# EAGLE design H1FR50 (EAGLE 9.6.2)

## Sheet 1 of 2
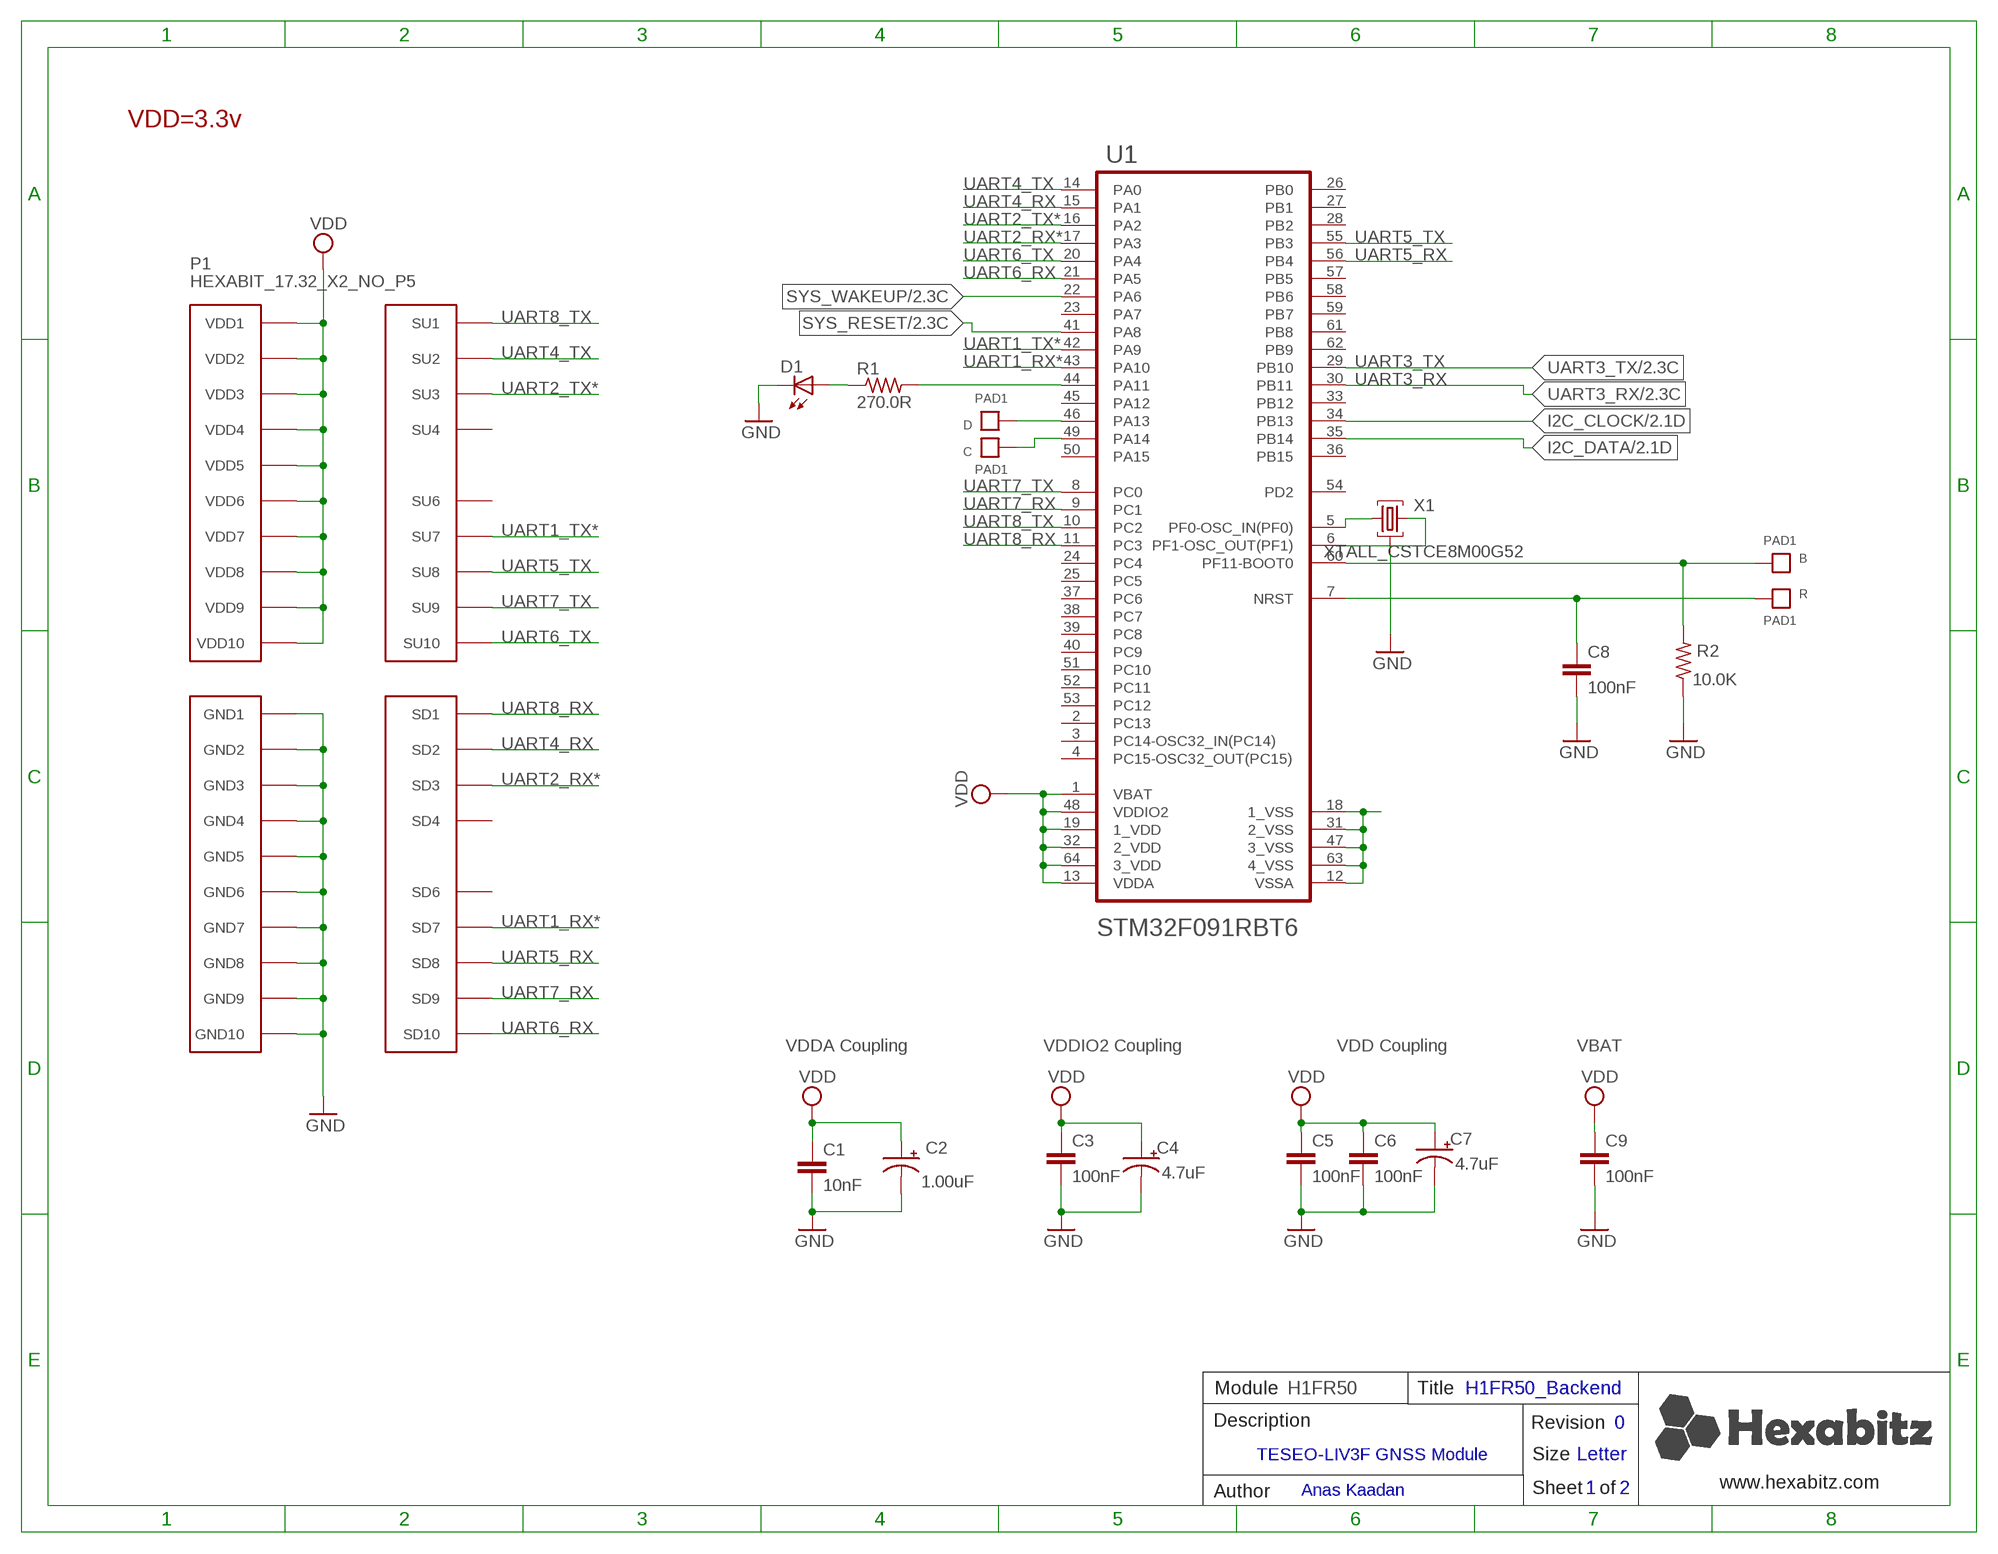
[diagram p0: schematic, sheet 1]

### Parts
B  PAD1  [PAD1]
C  PAD1  [PAD1]
C1  10nF  C-0603  [C-0603]
C2  1.00uF  C-0805-POL  [C-0805-POL]
C3  100nF  C-0603  [C-0603]
C4  4.7uF  C-0805-POL  [C-0805-POL]
C5  100nF  C-0603  [C-0603]
C6  100nF  C-0603  [C-0603]
C7  4.7uF  C-0805-POL  [C-0805-POL]
C8  100nF  C-0603  [C-0603]
C9  100nF  C-0603  [C-0603]
D  PAD1  [PAD1]
D1  VLMS1300-GS08  [VLMS1300-GS08]
P1  HEXABIT_17.32_X2_NO_P5  [HEXABIT_17.32_X2_NO_P5]
R  PAD1  [PAD1]
R1  270.0R  R-0603  [R-0603]
R2  10.0K  R-0603  [R-0603]
U1  STM32F091RBT6STMICROELECTRONICS_STM32F091RBT6_0_1  [STMICROELECTRONICS_STM32F091RBT6_1]
X1  XTALL_CSTCE8M00G52  [XTALL_CSTCE8M00G52]

### Nets
B1: B.P$1 B.P$2 R2.2 U1.60(PF11-BOOT0)
GND: C1.2 C2.2(-) C3.2 C4.2(-) C5.2 C6.2 C7.2(-) C8.2 C9.2 D1.C P1.PAD_PD11(GND1) P1.PAD_PD12(GND2) P1.PAD_PD13(GND3) P1.PAD_PD14(GND4) P1.PAD_PD15(GND5) P1.PAD_PD16(GND6) P1.PAD_PD17(GND7) P1.PAD_PD18(GND8) P1.PAD_PD19(GND9) P1.PAD_PD20(GND10) R2.1 U1.12(VSSA) U1.18(1_VSS) U1.31(2_VSS) U1.47(3_VSS) U1.63(4_VSS) X1.P$2 ; also sheet 2
I2C_CLOCK: U1.34(PB13) ; also sheet 2
I2C_DATA: U1.35(PB14) ; also sheet 2
N$4: D1.A R1.1
N$5: U1.5(PF0-OSC_IN(PF0)) X1.P$1
N$6: U1.6(PF1-OSC_OUT(PF1)) X1.P$3
N$7: D.P$1 D.P$2 U1.46(PA13)
N$9: C.P$1 C.P$2 U1.49(PA14)
N$10: R1.2 U1.44(PA11)
R1: C8.1 R.P$1 R.P$2 U1.7(NRST)
SYS_RESET: U1.41(PA8) ; also sheet 2
SYS_WAKEUP: U1.22(PA6) ; also sheet 2
UART1_RX*: P1.PAD_PD7(SD7) U1.43(PA10)
UART1_TX*: P1.PAD_PU7(SU7) U1.42(PA9)
UART2_RX*: P1.PAD_PD3(SD3) U1.17(PA3)
UART2_TX*: P1.PAD_PU3(SU3) U1.16(PA2)
UART3_RX: U1.30(PB11) ; also sheet 2
UART3_TX: U1.29(PB10) ; also sheet 2
UART4_RX: P1.PAD_PD2(SD2) U1.15(PA1)
UART4_TX: P1.PAD_PU2(SU2) U1.14(PA0)
UART5_RX: P1.PAD_PD8(SD8) U1.56(PB4)
UART5_TX: P1.PAD_PU8(SU8) U1.55(PB3)
UART6_RX: P1.PAD_PD10(SD10) U1.21(PA5)
UART6_TX: P1.PAD_PU10(SU10) U1.20(PA4)
UART7_RX: P1.PAD_PD9(SD9) U1.9(PC1)
UART7_TX: P1.PAD_PU9(SU9) U1.8(PC0)
UART8_RX: P1.PAD_PD1(SD1) U1.11(PC3)
UART8_TX: P1.PAD_PU1(SU1) U1.10(PC2)
VDD: C1.1 C2.1(+) C3.1 C4.1(+) C5.1 C6.1 C7.1(+) C9.1 P1.PAD_PU11(VDD1) P1.PAD_PU12(VDD2) P1.PAD_PU13(VDD3) P1.PAD_PU14(VDD4) P1.PAD_PU15(VDD5) P1.PAD_PU16(VDD6) P1.PAD_PU17(VDD7) P1.PAD_PU18(VDD8) P1.PAD_PU19(VDD9) P1.PAD_PU20(VDD10) U1.1(VBAT) U1.13(VDDA) U1.19(1_VDD) U1.32(2_VDD) U1.48(VDDIO2) U1.64(3_VDD) ; also sheet 2
Unconnected: P1.PAD_PD4(SD4) P1.PAD_PD6(SD6) P1.PAD_PU4(SU4) P1.PAD_PU6(SU6) U1.2(PC13) U1.3(PC14-OSC32_IN(PC14)) U1.4(PC15-OSC32_OUT(PC15)) U1.23(PA7) U1.24(PC4) U1.25(PC5) U1.26(PB0) U1.27(PB1) U1.28(PB2) U1.33(PB12) U1.36(PB15) U1.37(PC6) U1.38(PC7) U1.39(PC8) U1.40(PC9) U1.45(PA12) U1.50(PA15) U1.51(PC10) U1.52(PC11) U1.53(PC12) U1.54(PD2) U1.57(PB5) U1.58(PB6) U1.59(PB7) U1.61(PB8) U1.62(PB9)

### Notes on the sheet
- VDD=3.3v
- VDDA Coupling | VDDIO2 Coupling | VDD Coupling | VBAT
- Module | H1FR50 | Title | H1FR50_Backend
- Description | Revision | 0
- TESEO-LIV3F GNSS Module | Size | Letter
- www.hexabitz.com
- Author | Anas Kaadan | Sheet   of | 1 | 2
- C:/Users/Admin/Desktop/logodraft.bmp

## Sheet 2 of 2
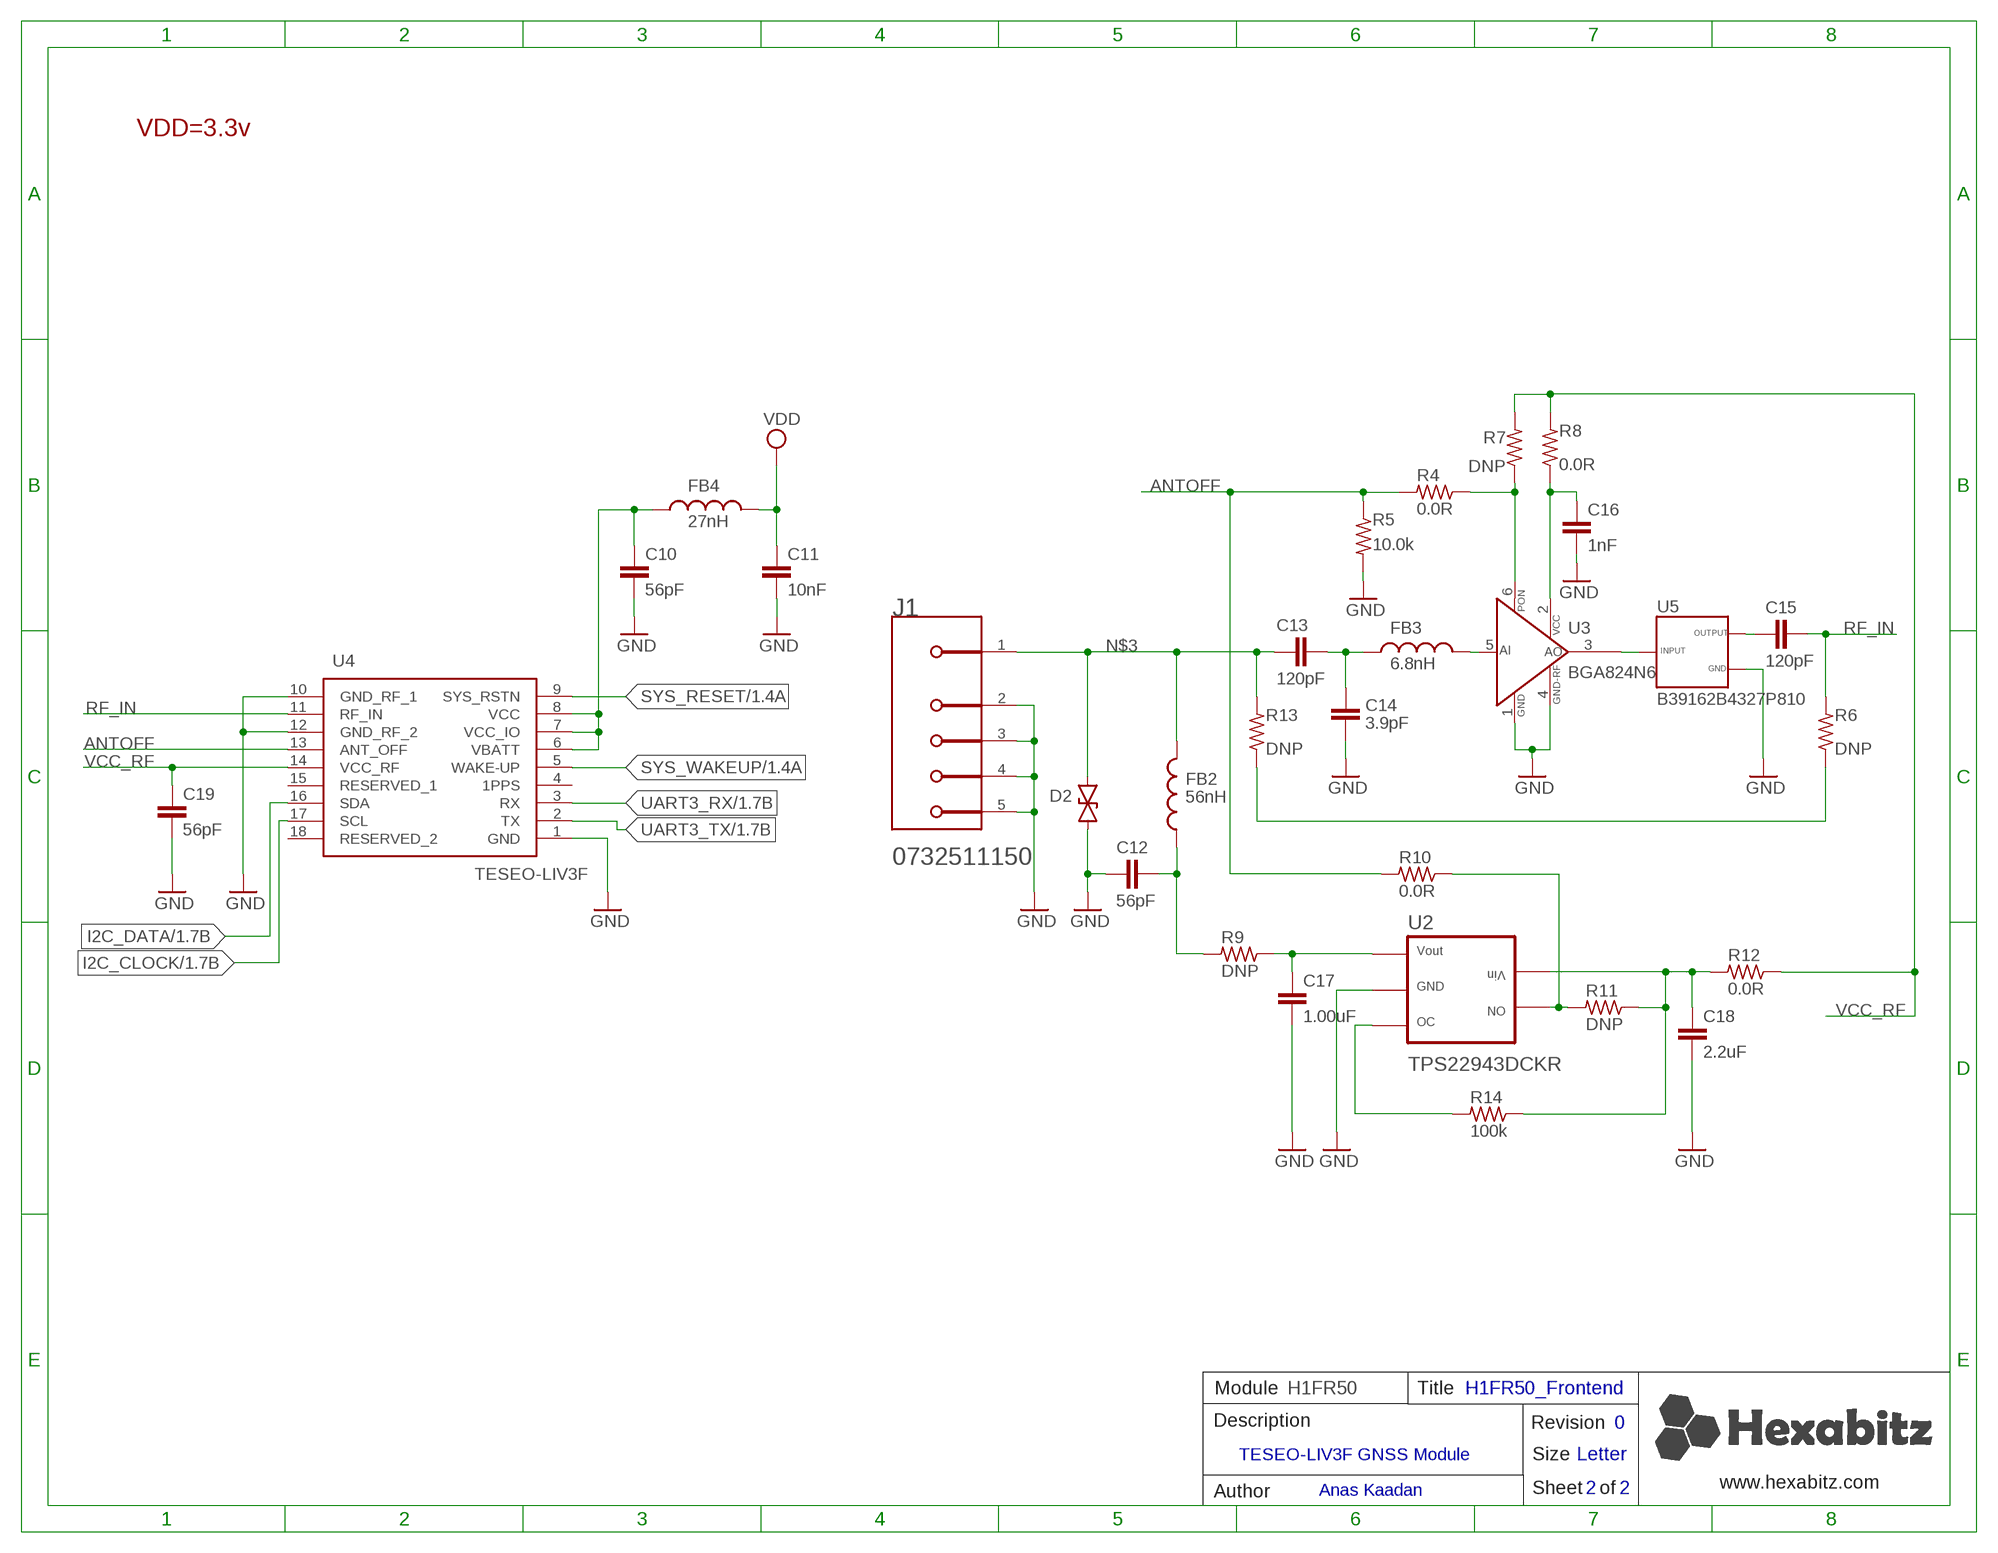
[diagram p1: schematic, sheet 2]

### Parts
C10  56pF  C-0201C0201  [C-0201]
C11  10nF  C-0402  [C-0402]
C12  56pF  C-0402  [C-0402]
C13  120pF  C-0402  [C-0402]
C14  3.9pF  C-0402  [C-0402]
C15  120pF  C-0402  [C-0402]
C16  1nF  C-0402  [C-0402]
C17  1.00uF  C-0402  [C-0402]
C18  2.2uF  C-0402  [C-0402]
C19  56pF  C-0201C0201  [C-0201]
D2  ESDARF02-1BU2CK  [CAPC0201X13N]
FB2  56nH  FB-0402  [FB-0402]
FB3  6.8nH  FB-0402  [FB-0402]
FB4  27nH  FB-0402  [FB-0402]
J1  MOLEX_INC_0732511150MOLEX_INC_0732511150_0_0  [MOLEX_INC_0732511150_0]
R4  0.0R  R-0402  [R-0402]
R5  10.0k  R-0402  [R-0402]
R6  DNP  R-0402  [R-0402]
R7  DNP  R-0402  [R-0402]
R8  0.0R  R-0402  [R-0402]
R9  DNP  R-0402  [R-0402]
R10  0.0R  R-0402  [R-0402]
R11  DNP  R-0402  [R-0402]
R12  0.0R  R-0402  [R-0402]
R13  DNP  R-0402  [R-0402]
R14  100k  R-0603  [R-0603]
U2  TPS22943DCKR  [SOT65P210X110-5N]
U3  BGA824N6  [BGA824N6]
U4  TESEO-LIV3F  [SON110P970X1010X230-18N]
U5  B39162B4327P810  [FIL_B39162B4327P810]

### Nets
ANT_IN: R6.1 R13.1
ANTOFF: R4.2 R5.1 R10.2 U4.13(ANT_OFF)
GND: C10.1 C11.1 C12.1 C14.1 C16.2 C17.2 C18.2 C19.1 D2.1 J1.2(MNT_1) J1.3(MNT_2) J1.4(MNT_3) J1.5(MNT_4) R5.2 U2.2(GND) U3.1(GND) U3.4(GND-RF) U4.1(GND) U4.10(GND_RF_1) U4.12(GND_RF_2) U5.2(GND) U5.3(GND) U5.5(GND) ; also sheet 1
I2C_CLOCK: U4.17(SCL) ; also sheet 1
I2C_DATA: U4.16(SDA) ; also sheet 1
N$1: C13.2 C14.2 FB3.1
N$2: R14.2 U2.3(OC)
N$3: C13.1 D2.2 FB2.2 J1.1 R13.2
N$11: C12.2 FB2.1 R9.2
N$12: FB3.2 U3.5(AI)
N$13: U3.3(AO) U5.1(INPUT)
N$16: R4.1 R7.1 U3.6(PON)
N$17: C15.1 U5.4(OUTPUT)
N$19: C16.1 R8.1 U3.2(VCC)
N$20: C17.1 R9.1 U2.1(VOUT)
N$22: R10.1 R11.2 U2.4(ON)
N$23: C18.1 R11.1 R12.2 R14.1 U2.5(VIN)
RF_IN: C15.2 R6.2 U4.11(RF_IN)
SYS_RESET: U4.9(SYS_RSTN) ; also sheet 1
SYS_WAKEUP: U4.5(WAKE-UP) ; also sheet 1
UART3_RX: U4.3(RX) ; also sheet 1
UART3_TX: U4.2(TX) ; also sheet 1
VCC_RF: C19.2 R7.2 R8.2 R12.1 U4.14(VCC_RF)
VCC_RF1: C10.2 FB4.1 U4.6(VBATT) U4.7(VCC_IO) U4.8(VCC)
VDD: C11.2 FB4.2 ; also sheet 1
Unconnected: U4.4(1PPS) U4.15(RESERVED_1) U4.18(RESERVED_2)

### Notes on the sheet
- VDD=3.3v
- Module | H1FR50 | Title | H1FR50_Frontend
- Description | Revision | 0
- TESEO-LIV3F GNSS Module | Size | Letter
- www.hexabitz.com
- Author | Anas Kaadan | Sheet   of | 2 | 2

## Library data of the parts
B C D R = Hexabitz:PAD1
C1 = Hexabitz:C-0603: CAP CER 10% X7R 0603; CAPACITANCE: 10nF; MFN: KEMET; MPN: C0603C103K5RACTU; OCTOPART_URL: https://octopart.com/c0603c103k5ractu-kemet-133094?r=sp&s=R_iPBxLnSmGqhkU2rIMFpg; TOLERANCE: 10%; VOLTAGE_RATING: 50V
C2 = Hexabitz:C-0805-POL: Cap Tant Solid SMD 2012; CAPACITANCE: 1.00uF; MFN: Yageo; MPN: CC0805KKX7R7BB105; OCTOPART_URL: https://octopart.com/cc0805kkx7r7bb105-yageo-8376555?r=sp&s=YKl1wwtkROau_X5nniH2ig; TOLERANCE: 10%; VOLTAGE_RATING: 16V
C3 C6 C8 = Hexabitz:C-0603: CAP CER 10% X7R 0603; CAPACITANCE: 100nF; MFN: KEMET; MPN: C0603C104K8RACTU; OCTOPART_URL: https://octopart.com/c0603c104k8ractu-kemet-145075?r=sp&s=9bS9ASSwSEqMCE9KBEQZ0g; TOLERANCE: 10%; VOLTAGE_RATING: 10V
C4 C7 = Hexabitz:C-0805-POL: Cap Tant Solid SMD 2012; CAPACITANCE: 4.7uF; MFN: Murata; MPN: GRM21BC81E475KA12L; OCTOPART_URL: https://octopart.com/grm21bc81e475ka12l-murata-10331911?r=sp&s=RY3qZSD8T6mG6TC9CHI5qQ; TOLERANCE: 10%; VOLTAGE_RATING: 25V
C5 = Hexabitz:C-0603: CAP CER 10% X7R 0603; CAPACITANCE: 100nF; MFN: KEMET; MPN: C0603C104K8RACTU; OCTOPART_URL: https://octopart.com/c0603c104k8ractu-kemet-145075?r=sp&s=9bS9ASSwSEqMCE9KBEQZ0g; TOLERANCE: 10%; VOLTAGE_RATING: 10
C9 = Hexabitz:C-0603: CAP CER 10% X7R 0603; CAPACITANCE: 100nF; MFN: KEMET; MPN: C0603C104K8RACTU; OCTOPART_URL: https://octopart.com/c0603c104k8ractu-kemet-145075?r=sp&s=9bS9ASSwSEqMCE9KBEQZ0g; TOLERANCE: 10V; VOLTAGE_RATING: 10%
C10 C19 = HEXABITZ_RCLS:C-0201: CAPACITOR, European symbol; MFN: Murata; MPN: GRM0335C1E560GA01D; OCTOPART_URL: https://octopart.com/grm0335c1e560ga01d-murata-24611383?r=sp
C11 = HEXABITZ_RCLS:C-0402: CAP CER 10% 0402; CAPACITANCE: 10nF; MFN: TDK; MPN: CGA2B3X7R1H103K050BE; OCTOPART_URL: https://octopart.com/cga2b3x7r1h103k050be-tdk-68305469?r=sp
C12 = HEXABITZ_RCLS:C-0402: CAP CER 10% 0402; CAPACITANCE: 56pF; MFN: Murata; MPN: GRM1555C1H560JA01D; OCTOPART_URL: https://octopart.com/grm1555c1h560ja01d-murata-15197568?r=sp
C13 C15 = HEXABITZ_RCLS:C-0402: CAP CER 10% 0402; CAPACITANCE: 120pF; MFN: Murata; MPN: GRM1555C1H121JA01D; OCTOPART_URL: https://octopart.com/grm1555c1h121ja01d-murata-196010?r=sp
C14 = HEXABITZ_RCLS:C-0402: CAP CER 10% 0402; CAPACITANCE: 3.9pF; MFN: Murata; MPN: GRM1555C1H3R9WA01D; OCTOPART_URL: https://octopart.com/grm1555c1h3r9wa01d-murata-20477997?r=sp
C16 = HEXABITZ_RCLS:C-0402: CAP CER 10% 0402; CAPACITANCE: 1nF; MFN: Murata; MPN: GRM155R71H102KA01D; OCTOPART_URL: https://octopart.com/grm155r71h102ka01d-murata-196021?r=sp
C17 = HEXABITZ_RCLS:C-0402: CAP CER 10% 0402; CAPACITANCE: 1.00uF; MFN: KEMET; MPN: C0402C105K8PAC7411; OCTOPART_URL: https://octopart.com/c0402c105k8pac7411-kemet-75146233?r=sp
C18 = HEXABITZ_RCLS:C-0402: CAP CER 10% 0402; CAPACITANCE: 2.2uF; MFN: https://octopart.com/c0402c225k7pactu-kemet-89187402?r=sp; MPN: C0402C225K7PACTU; OCTOPART_URL: https://octopart.com/c0402c225k7pactu-kemet-89187402?r=sp
D1 = Hexabitz:VLMS1300-GS08: Red 0603 130° Clear 54 mcd 2 V Surface Mount ChipLED ; Octopart Url : http://octopart.com/vlms1300-gs08-vishay-21709201; MFN: Vishay; MPN: VLMS1300-GS08; OCTOPART_URL: https://octopart.com/vlms1300-gs08-vishay-21709201?r=sp&s=_gcP4_q8T1SC6PJQPTQ9yA
D2 = HEXABITZ_RCLS:ESDARF02-1BU2CK: ESDARF Series 5 V 0.2 pF Bi-Directional 1-Line ESD Protection TVS Diode - ST0201; MFN: STMicroelectronics; MPN: ESDARF02-1BU2CK; OCTO_URL: https://octopart.com/search?q=ESDARF02-1BU2CK&currency=USD&specs=0
FB2 = HEXABITZ_RCLS:FB-0402; MFN: Murata; MPN: LQW15AN6N8G00D; OCTOPART_URL: https://octopart.com/lqw15an6n8g00d-murata-7896134?r=sp
FB3 = HEXABITZ_RCLS:FB-0402; MFN: Würth Elektronik; MPN: 744784156A; OCTOPART_URL: https://octopart.com/744784156a-w%C3%BCrth+elektronik-46756303?r=sp
FB4 = HEXABITZ_RCLS:FB-0402; MFN: Murata; MPN: LQG15HS27NJ02D; OCTOPART_URL: https://octopart.com/lqg15hs27nj02d-murata-387555?r=sp
J1 = HEXABITZ_CONNECTION_PARTS:MOLEX_INC_0732511150: RF/COAXIAL SMA JACK STR 50OHM EDGE MOUNT; CONTACT_MATERIAL: Gold,Nickel; DATASHEET: https://www.molex.com/webdocs/datasheets/pdf/en-us/0732511150_RF_COAX_CONNECTORS.pdf; DEVICE_CLASS_L1: Connectors; DEVICE_CLASS_L2: RF / Coaxial Connectors; DEVICE_CLASS_L3: unset; DIELECTRIC_MATERIAL: PTFE; DIGIKEY_DESCRIPTION: CONN SMA RCPT STR 50OHM EDGE MNT; DIGIKEY_PART_NUMBER: WM5534-ND; FOOTPRINT_URL: https://www.molex.com/pdm_docs/sd/732511150_sd.pdf; FOOTPRINT_VARIANT_NAME_0: Recommended_Land_Pattern; FREQUENCY: 18GHz; IMPEDANCE: 50Ω; IS_FEMALE: yes; LEAD_FREE: Yes; MF: Molex Inc; MFG_PACKAGE_IDENT: 0; MFG_PACKAGE_IDENT_DATE: 0; MFG_PACKAGE_IDENT_REV: 0; MOUSER_DESCRIPTION: RF Connectors / Coaxial Connectors SMA ST PCB-JCK STD EMT; MPN: 0732511150; NUMBER_OF_CONTACTS: 1; PACKAGE: CONN_RF_JACK; PREFIX: J; ROHS: Yes; SHIELDING: true; TEMPERATURE_RANGE_HIGH: +165°C; TEMPERATURE_RANGE_LOW: -65°C; VERIFICATION_VERSION: 0.0.0.3; VOLTAGE_RATING: 500V
P1 = hexabitz_connectors:HEXABIT_?_X2_NO_P5: Hexabitz Double Hexagon Module Connector Hexagon side length = 17.32mm. The following ports are removed: P5
R1 = Hexabitz:R-0603: Thick Film Resistors - SMD 0603; MFN: Yageo; MPN: RC0603FR-07270RL; OCTOPART_URL: https://octopart.com/search?q=RC0603FR-07270RL&start=0; RESISTANCE: 270.0 Ohm; TOLERANCE: 1%
R2 = Hexabitz:R-0603: Thick Film Resistors - SMD 0603; MFN: Yageo; MPN: RC0603JR-0710KL; OCTOPART_URL: https://octopart.com/search?q=RC0603JR-0710KL&start=0; RESISTANCE: 10.0K Ohm; TOLERANCE: 5%
R4 R6-R13 = HEXABITZ_RCLS:R-0402: Thick Film Resistors - SMD 0603
R5 = HEXABITZ_RCLS:R-0402: Thick Film Resistors - SMD 0603; MFN: TE Connectivity; MPN: CRGCQ0402F10K; OCTOPART_URL: https://octopart.com/crgcq0402f10k-te+connectivity-91017932?r=sp; RESISTANCE: 10.0K; TOLERANCE: ±1%
R14 = HEXABITZ_RCLS:R-0603: Thick Film Resistors - SMD 0603; MFN: Yageo; MPN: AC0603FR-07100KL; OCTOPART_URL: https://octopart.com/ac0603fr-07100kl-yageo-21711090?r=sp; RESISTANCE: 100k; TOLERANCE: ±1%
U1 = Hexabitz:STM32F091RBT6: MCU 32-bit ARM Cortex M0 RISC 128KB Flash 2.5V/3.3V 64-Pin LQFP Frame; CIIVA_IDS: 20240711; COMPONENT_LINK_1_DESCRIPTION: Manufacturer URL; COMPONENT_LINK_1_URL: http://www.st.com/; CORE: ARM Cortex-M0; DATASHEET: http://www.st.com/st-web-ui/static/active/en/resource/technical/document/datasheet/DM00115237.pdf; DATASHEET_VERSION: Rev. 2; DA_CONVERTER: 1; FLASH_SIZE_PROG_KB: 128; FOOTPRINT_VARIANT_NAME_0: Level C; FOOTPRINT_VARIANT_NAME_1: Level B; FOOTPRINT_VARIANT_NAME_2: Level A; IMPORTED: yes; IMPORTED_FROM: vault; IMPORT_TS: 1521852803; INTERNAL_RAM_SIZE_KB: 32; IOS_HIGH_CURRENT: 52; MF: STMicroelectronics; MFN: STMicroelectronics; MOUNTING_TECHNOLOGY: Surface Mount; MPN: STM32F091RBT6; OCTOPART_URL: https://octopart.com/stm32f091rbt6-stmicroelectronics-51988681?r=sp&s=nshh1g3RRwuzez1YsQrt1w; OPERATING_FREQUENCYF_PROCESSOR_SPEED_MHZ: 48; PACKAGE_DESCRIPTION: 64-Pin Low-profile Quad Flat Package, Body 10 x 10 mm, Pitch 0.5 mm; PACKAGE_REFERENCE: LQFP64; PACKING: Tray; PREFIX: U; RELEASE_DATE: 1490161467; SUPPLY_VOLTAGEVCC_MIN_V: 2; VAULT_GUID: 95B06E5F-7F06-470A-8EBC-FD74529BF319; VAULT_REVISION: C6B60D25-65BF-47EB-8D85-05054791449B
U2 = HEXABITZ_ICs:TPS22943DCKR: 5.5-V, 0.04-A, 500-mΩ, load switch with current limit and active high enable 5-SC70 -40 to 85; DESCRIPTION: 5.5-V, 0.04-A, 500-mΩ, load switch with current limit and active high enable 5-SC70 -40 to 85; MFN: Texas Instruments; MPN: TPS22943DCKR; PACKAGE: SOT-SC70-5 Texas Instruments; PURCHASE-URL: https://octopart.com/tps22943dckr-texas+instruments-12189794?r=sp
U3 = HEXABITZ_ICs:BGA824N6: BGA824N6 1.5 to 3.3 V 0.55 dB SMT Front End Low Noise Amplifier - TSNP-6-2; DESCRIPTION: GPS Amp Single Low Noise Amplifier 1615MHz 3.3V 6-Pin TSNP T/R; MFN: Infineon; MPN: BGA824N6E6327XTSA1; OCTO_URL: https://octopart.com/bga824n6e6327xtsa1-infineon-33343805?r=sp
U4 = HEXABITZ_ICs:TESEO-LIV3F: GPS Modules Tiny GNSS module; DESCRIPTION: - RF Receiver BeiDou, Galileo, GLONASS, GNSS, GPS 1.575GHz -163dBm 18-LCC (9.7x10.1); MF: STMicroelectronics; MP: TESEO-LIV3F; PACKAGE: SMD-18 STMicroelectronics; PURCHASE-URL: https://octopart.com/teseo-liv3f-stmicroelectronics-84762432?r=sp
U5 = HEXABITZ_ICs:B39162B4327P810: Frequency RF SAW Filter (Sound Acoustic Wave) Bandwidth 5-SMD; DESCRIPTION: Low-loss RF GPS + COMPASS + Galileo + GLONASS filter 1582.4 MHz; MFN: RF360 Holdings; MPN: B39162B4327P810; PACKAGE: SMD-5 TDK; PURCHASE-URL: https://octopart.com/b39162b4327p810-rf360+holdings-78742154?r=sp
X1 = Hexabitz:XTALL_CSTCE8M00G52: MURATA CSTCE8M00G52-R0 RESONATOR, SMD, 8MHZ ; Octopart Url : https://octopart.com/cstce8m00g52-r0-murata-7145559; MFN: Murata; MPN: CSTCE8M00G52Z-R0; OCTOPART_URL: https://octopart.com/cstce8m00g52z-r0-murata-17755941?r=sp&s=JDnNJnrHQhyS8Zk4ofFWXw

## Board
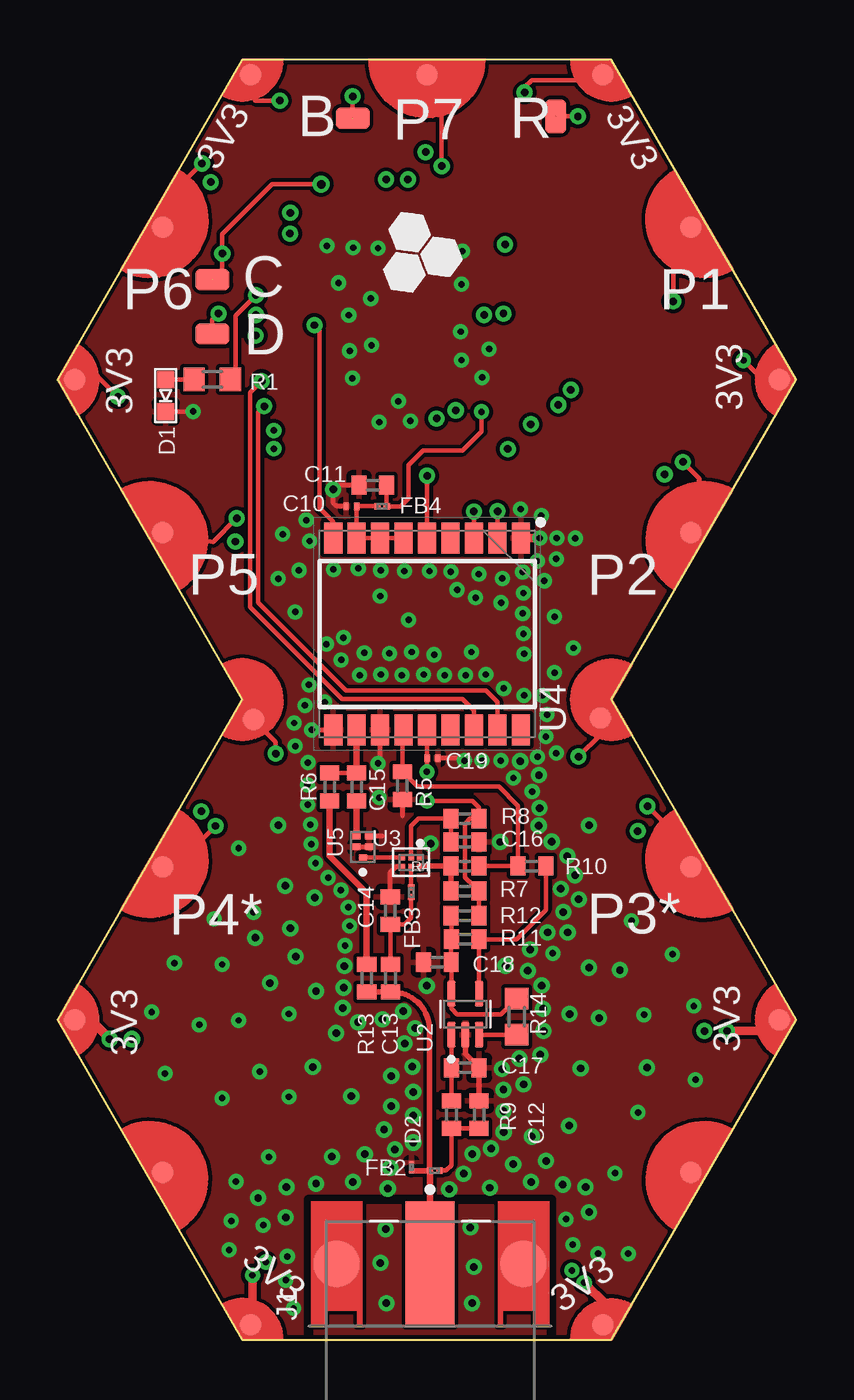
[diagram p2: board, top side]
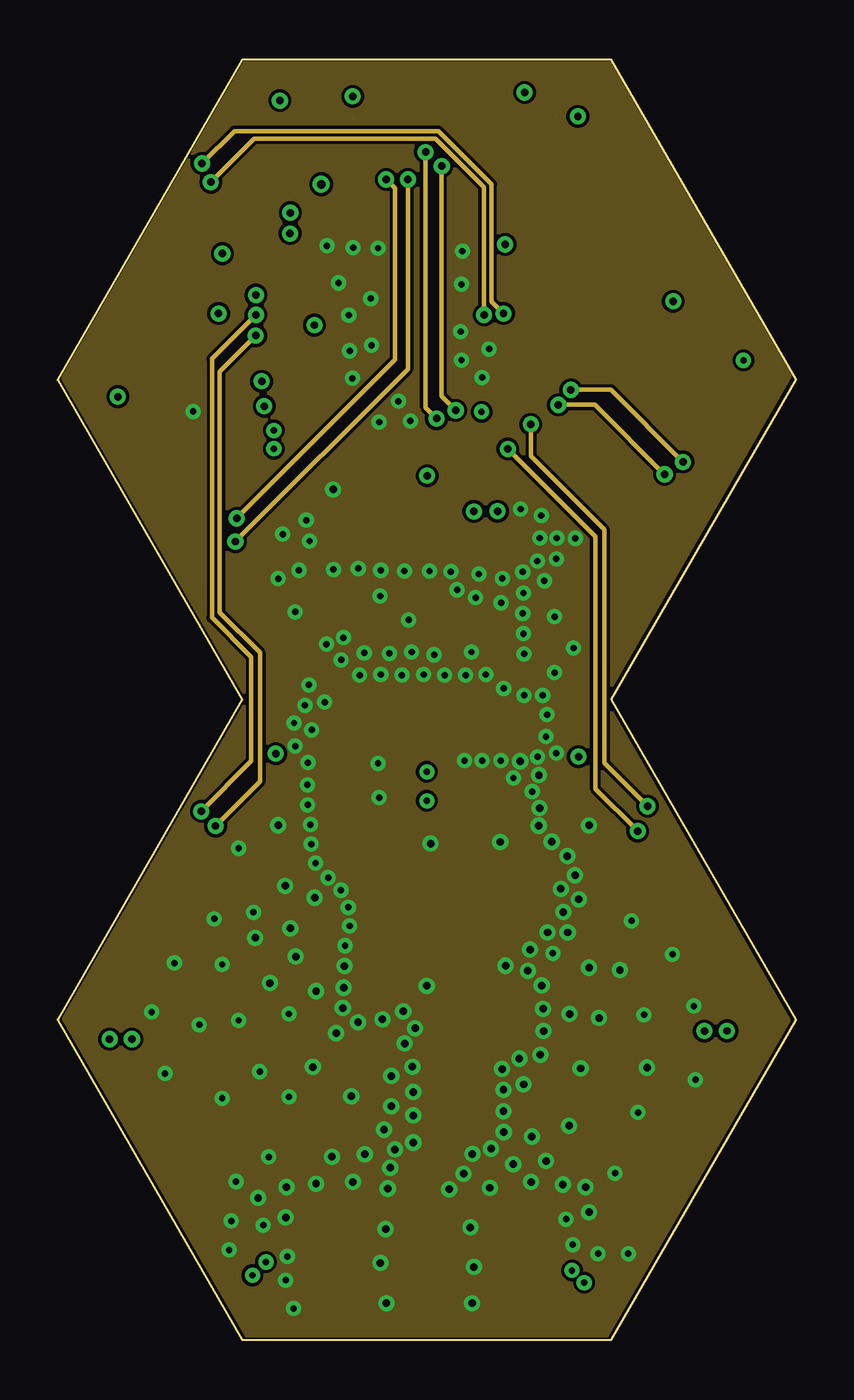
[diagram p3: board, inner layer Route2]
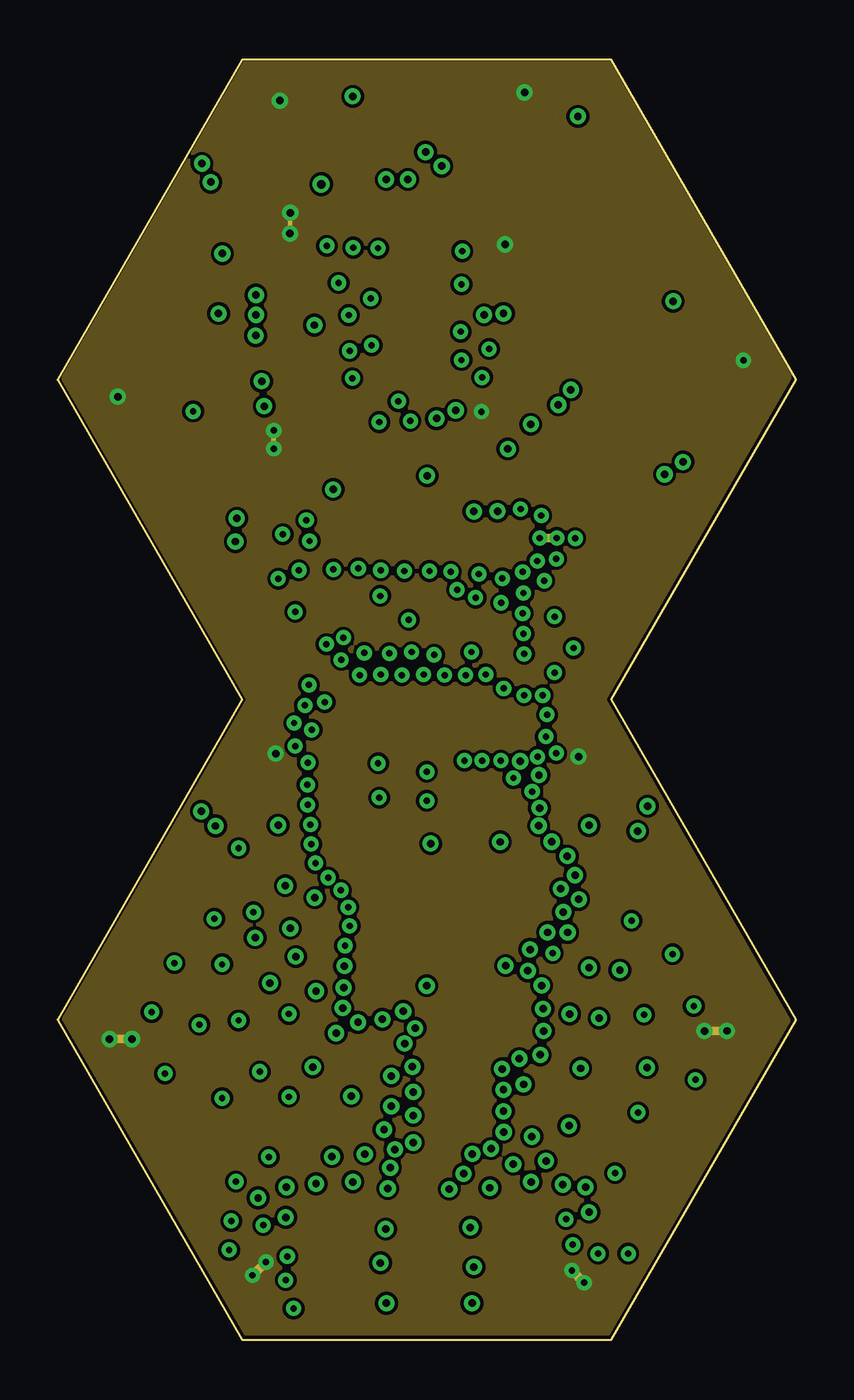
[diagram p4: board, inner layer Route15]
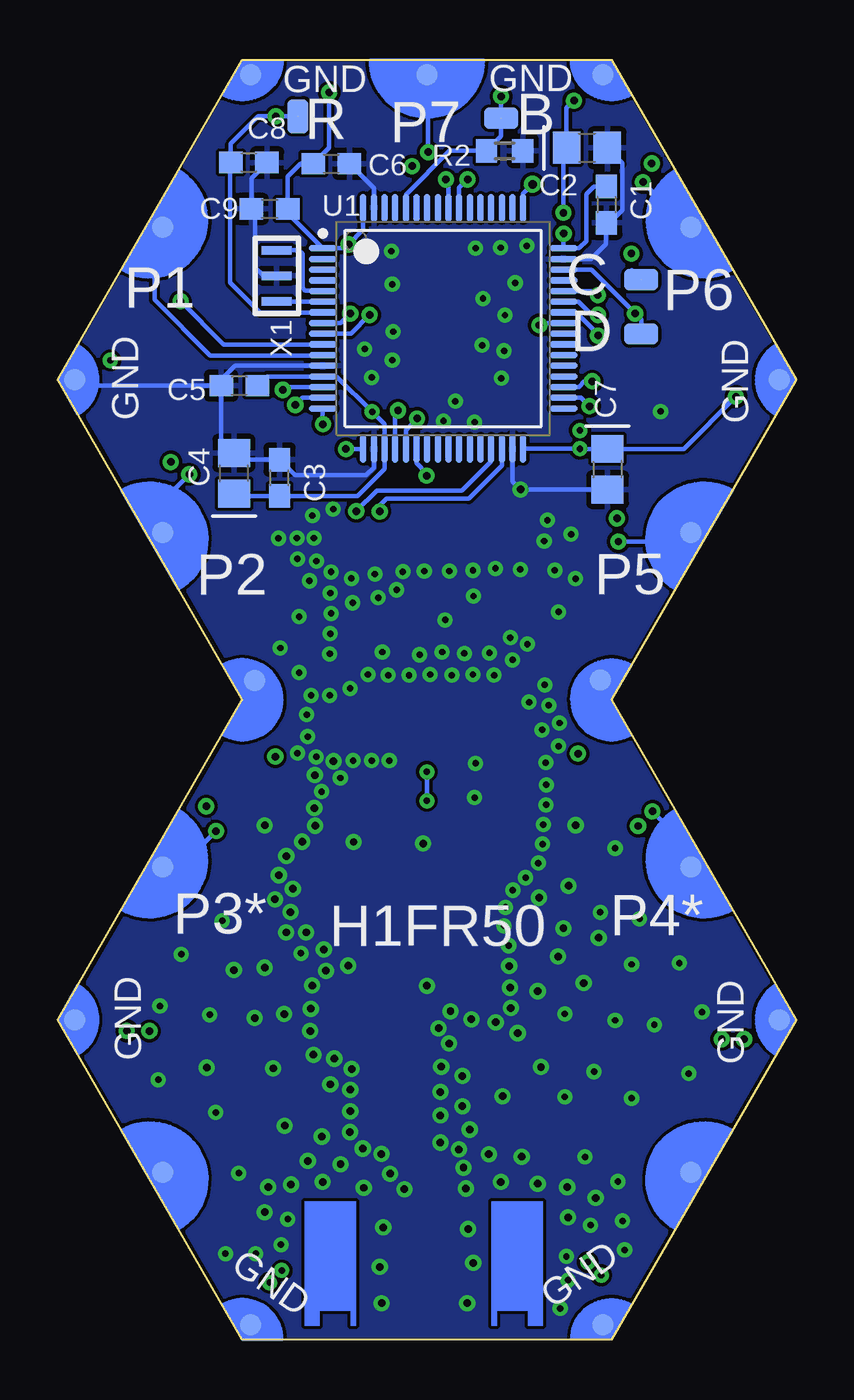
[diagram p5: board, bottom side, seen from below]

Size 34.64 x 60 mm. Coordinates in mm from the lower left corner, seen from the top.
Copper layers ([[2:1*2+15*16:15]:2]): Top 0.035mm / dielectric 0.175mm / Route2 0.035mm / dielectric 1.11mm / Route15 0.035mm / dielectric 0.175mm / Bottom 0.035mm
Design rules "2_layer *": minimum track width 7mil, minimum drill 10mil, track to track 6mil, track to pad 6mil, pad to pad 6mil, via to via 6mil, smd to smd 0mil, copper to edge 1mil, drill to drill 8mil, minimum pad ring 10mil, minimum via ring 8mil, stop-mask expansion 2mil, vias tented up to drill 15mil, thermal gap 10mil

### Footprints (pad centres in the part's own frame; a part is rotated, then mirrored left to right if it is on the bottom)
PAD1 = smd 1.6 x 1: P$1 0,0 | smd 1.6 x 1 bottom: P$2 0,0
C-0603 = smd 1.1 x 1: 1 -0.85,0; 2 0.85,0
C-0805-POL = smd 1.3 x 1.5: 1 -0.95,0; 2 0.95,0
C-0201 = smd 0.25 x 0.35: 1 -0.25,0; 2 0.25,0
C-0402 = smd 0.7 x 0.9: 1 -0.65,0; 2 0.65,0
VLMS1300-GS08 = smd 0.8 x 0.8: A 0,0.75; C 0,-0.75
CAPC0201X13N = smd 0.22 x 0.23: 1 -0.185,0; 2 0.185,0
FB-0402 = smd 0.29 x 0.3: 1 -0.222,0; 2 0.222,0
MOLEX_INC_0732511150_0 = smd 5.84 x 2.29: 1 5.309,0 | smd 2.173 x 2.173: 2 5.309,4.382; 3 5.309,-4.382; 4 5.309,4.382; 5 5.309,-4.382
HEXABIT_17.32_X2_NO_P5 = smd 1 x 1 bottom: PAD_PD1 12.39,7.15; PAD_PD2 12.39,-7.15; PAD_PD3 12.39,-22.85; PAD_PD4 12.39,-37.15; PAD_PD6 -12.39,-37.15; PAD_PD7 -12.39,-22.85; PAD_PD8 -12.39,-7.15; PAD_PD9 -12.39,7.15; PAD_PD10 0,14.31; PAD_PD12 16.52,0; PAD_PD13 8.069,-14.107; PAD_PD14 16.52,-30; PAD_PD15 8.26,-44.31; PAD_PD16 -8.26,-44.31; PAD_PD17 -16.52,-30; PAD_PD18 -8.133,-14.081; PAD_PD19 -16.52,0 | smd 1 x 1 rotated 60 bottom: PAD_PD11 8.26,14.307 | smd 1 x 1 rotated 120 bottom: PAD_PD20 -8.26,14.307 | smd 1 x 1: PAD_PU1 12.39,7.15; PAD_PU2 12.39,-7.15; PAD_PU3 12.39,-22.85; PAD_PU4 12.39,-37.15; PAD_PU6 -12.39,-37.15; PAD_PU7 -12.39,-22.85; PAD_PU8 -12.39,-7.15; PAD_PU9 -12.39,7.15; PAD_PU10 0,14.31; PAD_PU12 16.52,0; PAD_PU13 8.133,-15.847; PAD_PU14 16.52,-30; PAD_PU15 8.26,-44.31; PAD_PU16 -8.26,-44.31; PAD_PU17 -16.52,-30; PAD_PU18 -8.133,-15.936; PAD_PU19 -16.52,0 | smd 1 x 1 rotated 60: PAD_PU11 8.26,14.307 | smd 1 x 1 rotated 120: PAD_PU20 -8.26,14.307
R-0603 = smd 1 x 1.1: 1 -0.85,0; 2 0.85,0
R-0402 = smd 0.7 x 0.9: 1 -0.65,0; 2 0.65,0
STMICROELECTRONICS_STM32F091RBT6_1 = smd 1.3 x 0.3: 1 -5.65,3.75; 2 -5.65,3.25; 3 -5.65,2.75; 4 -5.65,2.25; 5 -5.65,1.75; 6 -5.65,1.25; 7 -5.65,0.75; 8 -5.65,0.25; 9 -5.65,-0.25; 10 -5.65,-0.75; 11 -5.65,-1.25; 12 -5.65,-1.75; 13 -5.65,-2.25; 14 -5.65,-2.75; 15 -5.65,-3.25; 16 -5.65,-3.75; 33 5.65,-3.75; 34 5.65,-3.25; 35 5.65,-2.75; 36 5.65,-2.25; 37 5.65,-1.75; 38 5.65,-1.25; 39 5.65,-0.75; 40 5.65,-0.25; 41 5.65,0.25; 42 5.65,0.75; 43 5.65,1.25; 44 5.65,1.75; 45 5.65,2.25; 46 5.65,2.75; 47 5.65,3.25; 48 5.65,3.75 | smd 0.3 x 1.3: 17 -3.75,-5.65; 18 -3.25,-5.65; 19 -2.75,-5.65; 20 -2.25,-5.65; 21 -1.75,-5.65; 22 -1.25,-5.65; 23 -0.75,-5.65; 24 -0.25,-5.65; 25 0.25,-5.65; 26 0.75,-5.65; 27 1.25,-5.65; 28 1.75,-5.65; 29 2.25,-5.65; 30 2.75,-5.65; 31 3.25,-5.65; 32 3.75,-5.65; 49 3.75,5.65; 50 3.25,5.65; 51 2.75,5.65; 52 2.25,5.65; 53 1.75,5.65; 54 1.25,5.65; 55 0.75,5.65; 56 0.25,5.65; 57 -0.25,5.65; 58 -0.75,5.65; 59 -1.25,5.65; 60 -1.75,5.65; 61 -2.25,5.65; 62 -2.75,5.65; 63 -3.25,5.65; 64 -3.75,5.65
SOT65P210X110-5N = smd 1.19 x 0.4: 1 -0.96,0.65; 2 -0.96,0; 3 -0.96,-0.65; 4 0.96,-0.65; 5 0.96,0.65
BGA824N6 = smd 0.25 x 0.25: 1 -0.2,0.4; 2 -0.2,0; 3 -0.2,-0.4; 4 0.2,-0.4; 5 0.2,0; 6 0.2,0.4
SON110P970X1010X230-18N = smd 1.45 x 0.85: 1 -4.5,4.4; 2 -4.5,3.3; 3 -4.5,2.2; 4 -4.5,1.1; 5 -4.5,0; 6 -4.5,-1.1; 7 -4.5,-2.2; 8 -4.5,-3.3; 9 -4.5,-4.4; 10 4.5,-4.4; 11 4.5,-3.3; 12 4.5,-2.2; 13 4.5,-1.1; 14 4.5,0; 15 4.5,1.1; 16 4.5,2.2; 17 4.5,3.3; 18 4.5,4.4
FIL_B39162B4327P810 = smd 0.3 x 0.375: 1 -0.5,0; 2 0,-0.287; 3 0.5,-0.287; 4 0.5,0.287; 5 0,0.287
XTALL_CSTCE8M00G52 = smd 1.4 x 0.4: P$1 0,1.2; P$2 0,0; P$3 0,-1.2

### Placement (x,y rotation side)
B  13.84,57.27 0 top
C  7.27,49.7 0 top
C1  8.9,53.21 270 bottom
C2  9.82,55.88 0 bottom
C3  24.23,40.4 90 bottom
C4  26.37,40.62 90 bottom
C5  26.11,44.73 180 bottom
C6  21.8,55.13 0 bottom
C7  8.85,40.81 270 bottom
C8  25.67,55.19 0 bottom
C9  24.7,53.01 180 bottom
C10  13.78,39.07 0 top
C11  14.79,40.06 0 top
C12  19.77,10.54 270 top
C13  15.62,16.95 90 top
C14  15.6,20.11 270 top
C15  14.03,25.91 90 top
C16  19.11,23.33 0 top
C17  19.12,12.74 0 top
C18  17.81,17.69 180 top
C19  17.58,27.27 180 top
D  7.27,47.16 180 top
D1  5.07,44.26 0 top
D2  16.59,8.09 270 top
FB2  17.69,7.93 180 top
FB3  16.58,20.97 90 top
FB4  15.22,39.07 0 top
J1  17.47,-1.75 90 top
P1  17.32,45 0 top
R  23.37,57.36 90 top
R1  7.26,45.02 0 top
R2  13.67,55.74 180 bottom
R4  19.11,22.2 0 top
R5  16.17,25.97 270 top
R6  12.76,25.91 90 top
R7  19.11,21.03 0 top
R8  19.11,24.43 0 top
R9  18.47,10.54 270 top
R10  22.24,22.2 180 top
R11  19.12,18.77 0 top
R12  19.11,19.88 180 top
R13  14.5,16.95 270 top
R14  21.53,15.14 270 top
U1  16.56,47.41 0 bottom
U2  19.12,15.26 90 top
U3  16.58,22.38 270 top
U4  17.33,33.09 270 top
U5  14.32,23.1 90 top
X1  24.36,49.87 0 bottom

### Tracks (layer width: path | path; a pad name or v marks a point on that pad's centre or on a via)
ANT_IN
  Top 0.305: R13.1 14.5,20.95 12.76,22.69 R6.1
ANTOFF
  Top 0.203: U4.13 16.17,28.53 R5.1 16.88,25.92 20.7,25.92 21.6,25.02 R10.2 R4.2
B1  (via drill 0.35)  (1 unrouted)
  Top 0.203: v13.84,58.29 B.P$1
  Bottom 0.203: U1.60 18.31,53.69 16.26,55.74 R2.2 13.84,56.42 v13.84,58.29
GND  (via drill 0.3, 0.35)
  Top 0.203: U5.5 U5.2 | R5.2 16.17,24.54 | 15.24,23.6 U5.3 | U4.10 v11.92,28.59 | v22.61,37.59 v22.61,37.58 | C19.1 18.96,27.27 v19.08,27.14 | v15.03,27.02 15.13,27.12 U4.12 | v6.36,43.51 v6.35,43.51 D1.C | C11.1 13.13,40.06 v12.93,39.86 12.93,39.22 13.07,39.07 C10.1 | C14.1 15.6,21.89 15.89,22.18 U3.4
  Top 0.254: C12.1 C17.2 19.12,13.39 U2.2
  Top 0.406: U4.1 v22.61,37.59
  Route15 0.406: v22.61,37.58 v23.41,37.58
  Bottom 0.203: C6.2 19.81,53.99 U1.63 | U1.47 9.62,50.66 8.93,51.35 C1.2 8.75,52.36 8.15,52.96 8.15,55.16 C2.2 8.93,55.82 | U1.12 26.32,45.66 26.96,45.02 C5.2 | C5.2 26.96,42.03 26.5,41.57 C4.2 26.05,41.25 C3.2 23.5,40.53 20.16,40.53 19.81,40.89 U1.18 | X1.P$2 24.97,49.87 25.37,50.27 25.37,52.84 C9.2 25.55,54.46 C8.2 | U1.31 13.31,40.24 v12.93,39.86 C7.2 | C5.2 33.57,44.73 P1.PAD_PD12
  Bottom 0.254: v24.19,32.42 v24.2,32.43
  other vias: 11.73,25.07 23.22,18.11 11.74,27.05 11.72,26.01 11.86,24.15 11.89,23.23 12.1,22.34 12.69,21.66 13.29,21.07 13.7,19.4 13.63,20.27 13.48,18.47 10.85,15.27 8.49,23.04 9.19,20.03 7.35,19.73 5.48,17.66 4.41,15.36 5.04,12.47 6.65,14.76 7.72,17.59 8.49,14.96 9.48,12.56 7.72,11.32 10.85,11.38 9.65,5.36 8.05,4.21 8.36,7.41 9.9,8.56 25.34,4.03 26.77,4.03 23.85,5.64 26.14,7.8 27.22,10.65 29.92,12.18 27.5,15.23 28.84,18.06 29.84,15.64 26.92,19.64 19.91,27.14 20.78,27.14 15.08,25.42 12.53,29.89 11.79,30.7 11.15,34.12 10.34,35.68 11.32,36.07 10.56,37.76 11.67,38.42 11.82,37.44 12.94,36.11 14.1,36.16 15.16,36.07 15.13,34.86 12.61,32.6 13.41,32.91 13.3,31.87 15.56,32.17 14.38,32.2 14.17,31.16 15.16,31.18 16.15,31.16 16.61,32.24 16.47,33.75 16.26,36.03 17.44,36.03 18.45,36.01 19.6,34.79 19.76,35.89 20.86,35.69 20.8,34.55 17.66,32.11 17.16,31.18 18.16,31.16 19.13,31.16 19.41,32.24 20.09,31.18 20.92,30.53 21.88,30.2 23.31,31.27 21.88,32.15 21.85,33.1 21.81,34.05 21.85,35 21.81,36 22.83,35.58 23.31,33.9 12.63,51.29 13.86,51.2 13.18,49.55 13.66,48.03 13.7,46.36 13.82,45.08 14.73,46.62 14.69,48.81 15.03,51.17 18.98,51.03 18.94,49.48 18.9,47.26 15.98,44 15.08,43.02 16.54,43.07 19.91,45.11 18.94,45.93 20.24,46.45 11.6,29.73 11.09,28.91 11.15,27.83 24.28,37.57 8.15,5.57 10.78,3.9 10.7,2.78 11.07,1.46 24.16,4.45 22.26,25.7 21.38,26.33 22.51,27.32 23.39,27.5 22.91,28.27 22.96,29.3 22.75,30.2 21.71,38.94 22.69,38.64 18.74,35.16 22.5,36.5 23.39,36.6 10.34,24.12 10.68,21.28 12.06,20.72 10.92,19.28 21.7,27.12 22.6,24.92 22.56,24.1 22.58,26.47 20.76,23.33 23.17,23.35 24.92,24.11 23.91,22.67 24.26,21.77 23.6,21.14 23.72,20.04 24.44,20.64 22.98,19.09 21.01,17.53 22.05,17.29 22.16,18.29 22.7,16.6 9.27,18.84 9.96,16.72 11.17,17.96 12.12,16.34 15.42,1.71 15.15,3.6 15.39,5.18 19.44,1.71 19.53,3.41 19.36,5.26 18.37,7.05 19.04,7.78 19.45,8.7 20.33,8.96 20.92,9.73 20.91,10.71 20.91,11.71 20.85,12.69 21.66,13.17 21.85,11.97 22.64,13.35 22.79,14.47 22.77,15.51 24.01,15.27 16.21,15.4 15.23,15.01 14.09,14.88 13.38,15.55 13.42,16.5 13.46,17.52 13.06,14.37 11.97,12.78 13.77,11.41 16.28,13.88 16.77,14.6 15.65,12.36 16.64,12.79 16.68,11.61 15.65,10.94 16.68,10.51 16.68,9.24 15.82,8.92 15.31,9.85 15.49,7.08 13.85,7.39 12.12,7.31 15.6,8.06 14.41,8.69 12.87,8.58 10.7,5.73 9.41,6.65 10.74,7.15 20.28,7.12 21.37,8.22 22.24,9.52 22.21,7.39 22.91,8.37 24.92,5.97 23.69,7.27 24.76,7.15 23.98,10.02 23.92,19.09 24.92,17.44 25.39,15.08 24.53,12.72 27.64,12.75 26.37,17.33 17.32,16.59 17.5,23.26
  pour Bottom: 8.73,59.91 0.21,45.16 8.94,30.01 0.3,15.03 8.87,0.18 25.76,0.18 34.27,14.92 25.59,30 34.39,45.28 25.95,59.91
  pour Route2: 8.75,59.88 0.22,45.13 8.94,30.01 0.3,15.03 8.87,0.19 25.77,0.19 34.3,14.97 25.62,30.03 34.39,45.24 25.93,59.88
  pour Top (isolate 0.178): 25.84,59.88 8.78,59.88 0.23,45.09 8.9,30.04 0.27,15.07 8.81,0.17 25.83,0.17 34.24,14.86 25.53,29.98 34.31,45.21
I2C_CLOCK  (via drill 0.35)
  Top 0.203: U4.17 20.63,29.9 20.1,30.42 13.53,30.42 9.4,34.55 9.4,43.48 v9.69,43.77
  Bottom 0.203: U1.34 10.09,44.16 v9.69,43.77
I2C_DATA  (via drill 0.35)
  Top 0.203: U4.16 19.53,29.5 18.99,30.04 13.34,30.04 9.03,34.35 9.03,44.4 v9.57,44.94
  Bottom 0.203: U1.35 10.2,44.66 9.93,44.94 v9.57,44.94
N$1
  Top 0.203: C13.2 15.62,19.44 C14.2 16.26,19.46 16.58,19.78 FB3.1
N$2
  Top 0.203: U2.3 R14.2
N$3
  Top 0.203: FB2.2 17.44,7.91
  Top 0.254: R13.2 C13.1 15.68,16.3 arc-90 17.45,14.52 17.45,7.97 17.46,7.95 FB2.2 | 17.44,7.91 D2.2
  Top 0.305: J1.1 FB2.2
N$4
  Top 0.203: D1.A R1.1
N$5
  Bottom 0.203: U1.5 22.23,49.19 23.03,49.19 23.16,49.32 23.16,50.9 23.33,51.07 X1.P$1
N$6
  Bottom 0.203: X1.P$3 24.35,48.66 U1.6
N$7  (via drill 0.35)
  Top 0.203: v7.55,48.11 7.26,47.82 7.26,47.43 7.27,47.41 D.P$1
  Bottom 0.203: U1.46 9.6,50.16 v7.55,48.11 7.27,47.83 D.P$1
N$9  (via drill 0.35, 0.4)  (1 unrouted)
  Top 0.203: C.P$1 7.73,50.16 v7.73,50.92 7.73,51.83 10.07,54.17 v12.36,54.17
  Bottom 0.203: C.P$1 7.72,50.14 | U1.49 12.81,53.73 v12.36,54.17
N$10  (via drill 0.35)
  Top 0.203: v9.31,48.97 8.35,48.02 8.35,45.26 R1.2
  Bottom 0.203: U1.44 9.5,49.16 v9.31,48.97
N$11
  Top 0.203: FB2.1 18.23,7.93 18.47,8.18 R9.2 C12.2
N$12
  Top 0.203: FB3.2 U3.5
N$13
  Top 0.203: U5.1 16.16,22.6 U3.3
N$16
  Top 0.254: U3.6 17,22.2 R4.1 R7.1
N$17
  Top 0.305: U5.4 C15.1
N$19
  Top 0.203: U3.2 16.58,24.08 16.92,24.43 R8.1 C16.1
N$20
  Top 0.203: R9.1 C17.1 U2.1
N$22
  Top 0.203: R10.1 22.9,20.15 21.52,18.77 R11.2 U2.4
N$23
  Top 0.203: R12.2 18.47,19.87 R11.1 C18.1 18.47,17.69 U2.5 18.47,15.53 18.74,15.26 20.8,15.26 R14.1
R1  (via drill 0.35)  (1 unrouted)
  Top 0.203: R.P$1 v24.4,57.36
  Bottom 0.203: U1.7 25.14,48.16 26.54,49.56 26.54,55.16 C8.1 26.52,56.07 25.23,57.36 R.P$1
RF_IN
  Top 0.203: U4.11 | C15.2 R6.2
  Top 0.305: C15.2 U4.11
SYS_RESET  (via drill 0.35)
  Top 0.203: v12.05,47.56 12.3,47.32 12.3,38.98 12.93,38.35 U4.9
  Bottom 0.203: U1.41 11.95,47.66 v12.05,47.56
SYS_WAKEUP  (via drill 0.35)
  Top 0.203: v17.33,40.5 U4.5
  Bottom 0.203: U1.22 17.81,41.09 17.33,40.61 v17.33,40.5
UART1_RX*  (via drill 0.35)
  Route2 0.203: v9.3,48.05 7.25,45.99 7.25,33.85 9.09,32.01 9.09,27.12 v6.74,24.77
  Bottom 0.203: U1.43 10.21,48.66 9.6,48.05 v9.3,48.05 | v6.74,24.77 5.09,23.12 P1.PAD_PD7
UART1_TX*  (via drill 0.35)
  Top 0.203: v7.41,24.08 5.59,22.26 P1.PAD_PU7
  Route2 0.203: v9.29,47.08 7.61,45.4 7.61,34.1 9.49,32.22 9.49,26.17 v7.41,24.08
  Bottom 0.203: U1.42 10.32,48.16 9.29,47.14 v9.29,47.08
UART2_RX*  (via drill 0.35)
  Route2 0.203: v21.11,41.76 25.23,37.65 25.23,25.82 v27.21,23.84
  Bottom 0.203: U1.17 v21.11,41.76 | v27.21,23.84 29.01,22.04 P1.PAD_PD3
UART2_TX*  (via drill 0.35)
  Top 0.203: v27.67,25.01 29.82,22.85 P1.PAD_PU3
  Route2 0.203: v22.19,42.92 22.19,41.42 25.64,37.98 25.64,27.04 v27.67,25.01
  Bottom 0.203: U1.16 v22.21,42.93 v22.19,42.92
UART3_RX  (via drill 0.35)
  Top 0.203: v19.53,38.83 U4.3
  Bottom 0.203: U1.30 13.81,40.97 15.35,39.42 19.22,39.42 19.53,39.12 v19.53,38.83
UART3_TX  (via drill 0.35)
  Top 0.203: U4.2 v20.63,38.84
  Bottom 0.203: U1.29 14.31,41.17 15.67,39.81 19.67,39.81 v20.63,38.84
UART4_RX  (via drill 0.35)
  Route2 0.203: v23.49,43.83 25.21,43.83 v28.47,40.57
  Bottom 0.203: U1.15 23.16,44.16 v23.49,43.83 | v28.47,40.57 29.91,39.12 P1.PAD_PD2
UART4_TX  (via drill 0.35)
  Top 0.203: v29.33,41.15 30.11,40.37 P1.PAD_PU2
  Route2 0.203: v24.07,44.53 25.95,44.53 v29.33,41.15
  Bottom 0.203: U1.14 23.94,44.66 v24.07,44.53
UART5_RX  (via drill 0.35)
  Route2 0.203: v16.43,54.4 16.43,45.51 v8.34,37.42
  Bottom 0.203: U1.56 16.31,54.27 v16.43,54.4 | v8.34,37.42 5,37.42 P1.PAD_PD8
UART5_TX  (via drill 0.35)
  Top 0.203: v8.4,38.51 7.29,37.4 P1.PAD_PU8
  Route2 0.203: v15.41,54.4 15.83,53.98 15.83,45.94 v8.4,38.51
  Bottom 0.203: U1.55 15.81,54 v15.41,54.4
UART6_RX  (via drill 0.35)
  Route2 0.203: v17.77,43.18 17.26,43.7 v17.26,55.68
  Bottom 0.203: U1.21 18.31,42.65 v17.77,43.18 | v17.26,55.68 17.26,59.7 P1.PAD_PD10
UART6_TX  (via drill 0.35)
  Top 0.203: P1.PAD_PU10 18.02,58.61 v18.02,55.02
  Route2 0.203: v18.67,43.57 18.02,44.23 v18.02,55.02
  Bottom 0.203: U1.20 18.81,43.44 v18.67,43.57
UART7_RX  (via drill 0.35)
  Route2 0.203: v20,48.05 20,54.02 17.71,56.31 9.22,56.31 v7.18,54.27
  Bottom 0.203: U1.9 20.89,47.16 v20,48.05 | v7.18,54.27 5.09,52.18 P1.PAD_PD9
UART7_TX  (via drill 0.35)
  Top 0.203: v6.78,55.15 6.1,54.47 6.1,53.99 5.51,53.4 4.99,52.49 P1.PAD_PU9
  Route2 0.203: v20.91,48.11 20.36,48.66 20.36,54.17 17.86,56.67 8.3,56.67 v6.78,55.15
  Bottom 0.203: U1.8 21.36,47.66 v20.91,48.11
UART8_RX
  Bottom 0.203: U1.11 22.23,46.14 27.48,46.14 30.09,48.76 30.09,51.77 P1.PAD_PD1
UART8_TX  (via drill 0.35)
  Top 0.203: v28.87,48.68 28.87,51.31 P1.PAD_PU1
  Bottom 0.203: U1.10 26.85,46.66 v28.87,48.68
VCC_RF  (via drill 0.3)
  Top 0.203: R12.1 R7.2 19.32,21.47 19.3,21.47 19.11,21.67 19.11,24.18 19.35,24.43 R8.2 19.76,24.96 19.45,25.26 v17.32,25.26 | U4.14 C19.2 17.33,26.64 v17.32,26.62
  Bottom 0.203: v17.32,26.62 v17.32,25.26
VCC_RF1
  Top 0.203: U4.6 U4.7 U4.8 C10.2 FB4.1
VDD  (via drill 0.3, 0.35)
  Top 0.203: v19.88,43.5 19.88,42.57 18.99,41.68 17.14,41.68 16.45,41 16.45,39.44 16.09,39.07 FB4.2 C11.2 | P1.PAD_PU20 9.28,58.09 v10.42,58.09 | v2.83,44.21 0.98,46.05 P1.PAD_PU19 | 31.44,14.48 31.43,14.47 v31.39,14.47 | v21.9,58.47 21.9,58.72 22.24,59.05 25.33,59.05 P1.PAD_PU11 | P1.PAD_PU12 33.08,45 v32.16,45.91 | P1.PAD_PU18 10.23,28.02 v10.23,27.47 | P1.PAD_PU13 25.45,28.36 v24.43,27.33
  Top 0.406: v9.14,3.01 9.14,1.18 P1.PAD_PU16 | P1.PAD_PU15 25.73,1.63 v24.7,2.67 | P1.PAD_PU14 33.92,14.48 31.44,14.48 | P1.PAD_PU17 0.91,15.63 v2.44,14.09
  Route15 0.203: v10.9,51.86 10.9,52.82 v10.92,52.84 | v10.14,41.77 v10.14,42.62
  Route15 0.305: v30.34,14.47 | v3.49,14.09 | v9.14,3.01 9.15,3.01
  Route15 0.406: v24.12,3.24 v24.7,2.67 | v30.34,14.47 v31.39,14.47 | v2.44,14.09 v3.49,14.09 | 9.15,3.01 v9.77,3.64
  Bottom 0.203: 8.94,54.06 C1.1 9.49,54.06 9.85,53.7 9.85,51.5 10.19,51.16 U1.48 v10.91,51.86 v10.9,51.86 | C4.1 26.25,39.55 C3.1 20.58,39.55 19.31,40.83 U1.19 19.31,42.92 v19.88,43.5 21.54,45.16 U1.13 24.82,45.16 C5.1 | 22.67,55.11 C6.1 | C6.1 23.24,55.13 23.85,54.53 C9.1 23.85,52.8 U1.1 21.18,51.16 v20.99,51.35 20.31,52.03 U1.64 | 10.9,55.75 C2.1 | U1.32 12.79,41.77 v10.14,41.77 v10.13,41.76 C7.1 5.28,41.76 v2.83,44.21 | 10.89,55.76 C2.1 | v10.42,58.09 10.77,57.75 C2.1 | C6.1 21.9,55.88 v21.9,58.47 | v10.92,52.84 10.92,55.73 C2.1
  pour Route15: 8.75,59.9 0.22,45.13 8.94,30.01 0.3,15.03 8.81,0.3 25.83,0.3 34.3,14.97 25.64,30.01 34.4,45.23 25.93,59.9

### Text on the board
tPlace: P7 | 3V3 | 3V3 | P6 | P1 | 3V3 | 3V3 | P5 | P2 | P4* | P3* | 3V3 | 3V3 | 3V3 | 3V3
bPlace: GND | GND | P7 | P6 | P1 | GND | GND | P5 | P2 | P4* | P3* | H1FR50 | GND | GND | GND | GND
bNames: B | R | C | D
Document: Total Thickness 1.6 mm / --------------------------------------------------------- / / copper_top_l1.gbr : Top Conductor - Copper: Thickness 0.035 mm / / Dielectric - FR-4: Thickness 0.175 mm / / copper_inner_l2.gbr : GND Plane - Copper: Thickness 0.035 mm / / Dielectric - FR-4: Thickness 1.11 mm / / copper_inner_l3.gbr : VDD Plane - Copper: Thickness 0.035 mm / / Dielectric - FR-4: Thickness 0.175 mm / / copper_bottom_l4.gbr : Bottom Conductor - Copper: Thickness 0.035 mm